# EAGLE design AdaptSensor (EAGLE 9.5.2)
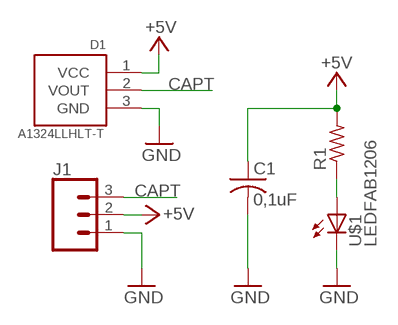
[diagram p0: schematic, sheet 1]

## Parts
C1  0,1uF  CAP-US1206FAB  [C1206FAB]
D1  A1324LLHLT-T  [SOT190P290X100-3N]
J1  CONN_03POLAR  [MOLEX-1X3]
R1  RES-US1206FAB  [R1206FAB]
U$1  LEDFAB1206  [LED1206FAB]

## Nets
+5V: C1.1 D1.1(VCC) J1.2 R1.2
CAPT: D1.2(VOUT) J1.3
GND: C1.2 D1.3(GND) J1.1 U$1.2(C)
N$1: R1.1 U$1.1(A)

## Library data of the parts
C1 = fab:CAP-US
D1 = A1324LLHLT-T:A1324LLHLT-T: Low Noise Linear Hall Effect w/Analog Output; AVAILABILITY: Unavailable; DESCRIPTION: Hall Effect Sensor Single Axis SOT-23W; MF: Allegro; MP: A1324LLHLT-T; PACKAGE: SOT-23-3 Allegro Microsystems LLC; PRICE: None
J1 = CONNECTORS:CONN_03: Multi connection point. Often used as Generic Header-pin footprint for 0.1 inch spaced/style header connections On any of the 0.1 inch spaced packages, you can populate with these: Break Away Headers - Straight <https://www.sparkfun.com/products/116> (PRT-00116) Break Away Male Headers - Right Angle <https://www.sparkfun.com/products/553> (PRT-00553) Female Headers <https://www.sparkfun.com/products/115> (PRT-00115) Break Away Headers - Machine Pin <https://www.sparkfun.com/products/117> (PRT-00117) Break Away Female Headers - Swiss Machine Pin <https://www.sparkfun.com/products/743> (PRT-00743) Stackable Header - 3 Pin (Female, 0.1") <https://www.sparkfun.com/products/13875> (PRT-13875) For SCREWTERMINALS and SPRING TERMINALS visit here: Screw Terimnals on SparkFun.com <https://www.sparkfun.com/search/results?term=Screw+Terminals> (5mm/3.5mm/2.54mm spacing) This device is also useful as a general connection point to wire up your design to another part of your project. Our various solder wires solder well into these plated through hole pads. Hook-Up Wire - Assortment (Stranded, 22 AWG) <https://www.sparkfun.com/products/11375> (PRT-11375) Hook-Up Wire - Assortment (Solid Core, 22 AWG) <https://www.sparkfun.com/products/11367> (PRT-11367) View the entire wire category on our website here <https://www.sparkfun.com/categories/141> Special notes: Molex polarized connector foot print use with SKU : PRT-08232 with associated crimp pins and housings.; PROD_ID: CONN-08625; SF_ID: PRT-08096
R1 = fab:RES-US: Resistor (US Symbol) Variants with postfix FAB are widened to allow the routing of internal traces
U$1 = fab:LED: LED

## Board
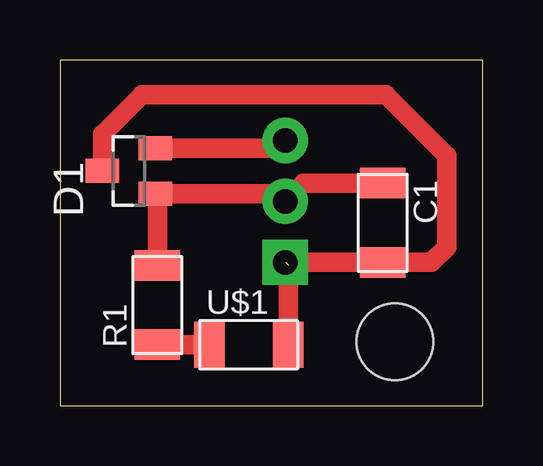
[diagram p1: board, top side]
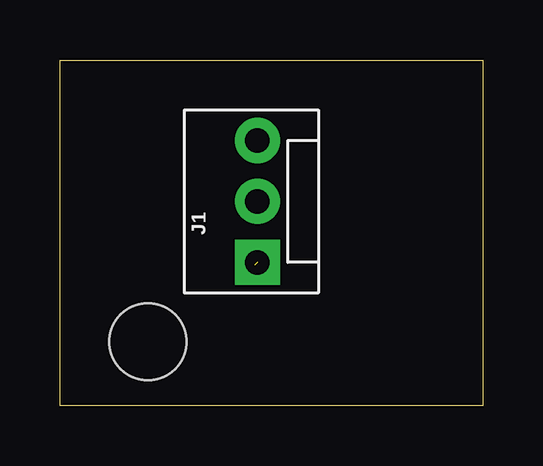
[diagram p2: board, bottom side, seen from below]

Size 17.63 x 14.4 mm. Coordinates in mm from the lower left corner, seen from the top.
Outline: 0,0 17.63,0 17.63,14.4 0,14.4 0,0
Copper layers (1*16): Top 0.035mm / dielectric 1.5mm / Bottom 0.035mm
Design rules "default": minimum track width 6mil, minimum drill 0.35mm, track to track 6mil, track to pad 6mil, pad to pad 6mil, via to via 6mil, smd to smd 6mil, copper to edge 40mil, drill to drill 6mil, minimum pad ring 10mil, minimum via ring 8mil, stop-mask expansion 4mil, vias tented up to drill 0mil, thermal gap 10mil
Holes 3.2 mm at 13.97,2.67

### Footprints (pad centres in the part's own frame; a part is rotated, then mirrored left to right if it is on the bottom)
C1206FAB = smd 1.27 x 1.905: 1 -1.651,0; 2 1.651,0
SOT190P290X100-3N = smd 1 x 1.4: 1 -0.95,0.21; 2 0.95,0.21; 3 0,2.412
MOLEX-1X3 = drill 1.016 pad 1.88 square: 1 0,0 | drill 1.016 pad 1.88: 2 2.54,0; 3 5.08,0
R1206FAB = smd 1.27 x 1.905: 1 -1.651,0; 2 1.651,0
LED1206FAB = smd 1.27 x 1.905: 1 -1.651,0; 2 1.651,0

### Placement (x,y rotation side)
C1  13.46,7.62 270 top
D1  4.19,9.78 90 top
J1  9.4,5.97 90 bottom
R1  4.06,4.19 90 top
U$1  7.87,2.54 0 top

### Tracks (layer width: path | path; a pad name or v marks a point on that pad's centre or on a via)
+5V
  Top 0.813: C1.1 10.16,9.27 J1.2 9.08,8.83 D1.1 4.06,8.75 R1.2
CAPT
  Top 0.813: D1.2 9.08,10.73 J1.3
GND  (1 unrouted)
  Top 0.813: U$1.2 9.53,5.84 | D1.3 1.78,11.3 3.43,12.95 13.59,12.95 16.13,10.41 16.13,6.6 15.49,5.97 C1.2 J1.1
N$1
  Top 0.813: R1.1 U$1.1